# EAGLE design UCirKitBreadboardTop-0824-DemoUse (EAGLE 7.3.0)
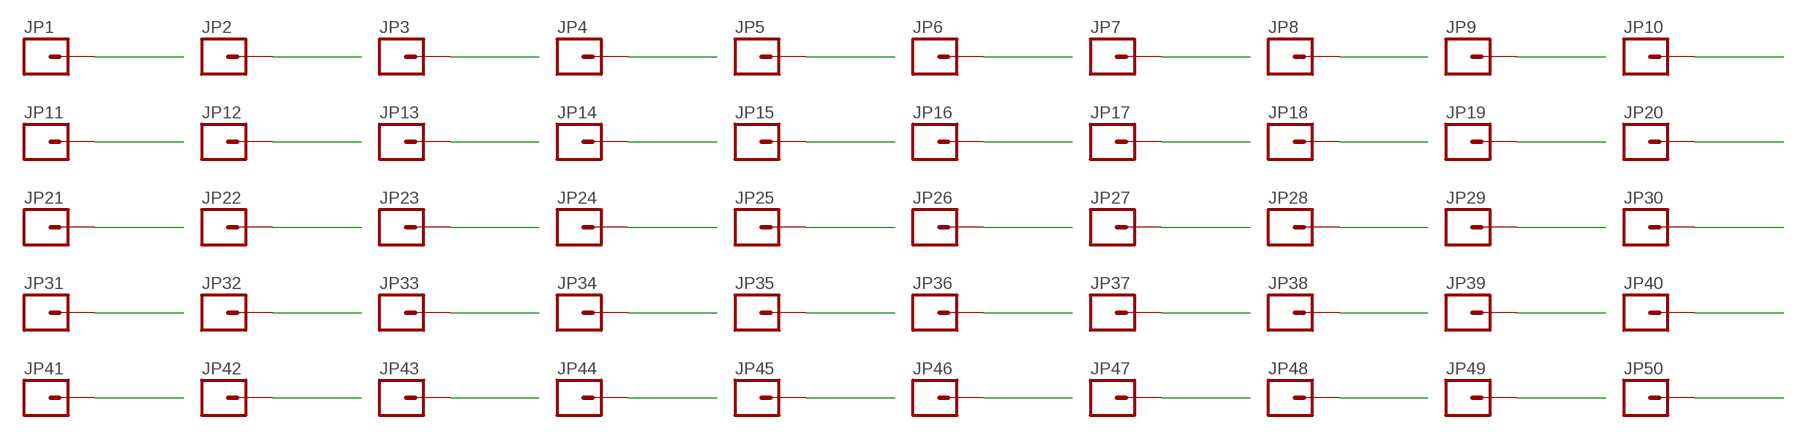
[diagram p0: schematic, sheet 1, part 1 of 2]
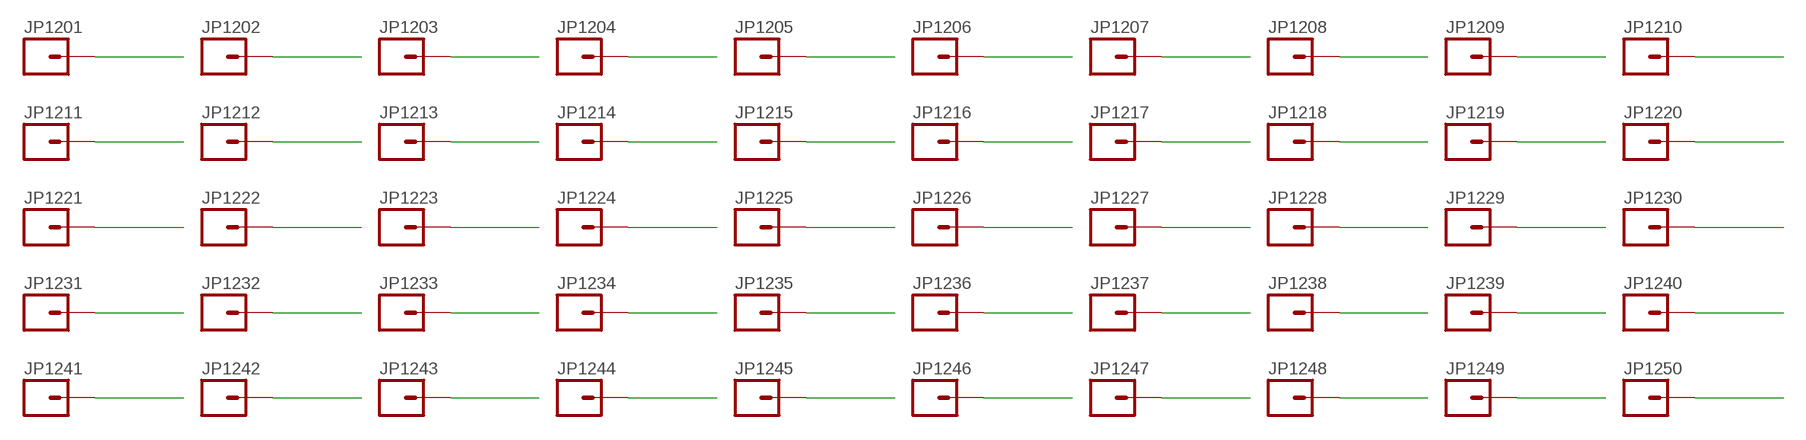
[diagram p1: schematic, sheet 1, part 2 of 2]

## Parts
JP1  M01PTH_WITHOUT_TEXT  [1X01_WITHOUT_TEXT]
JP2  M01PTH_WITHOUT_TEXT  [1X01_WITHOUT_TEXT]
JP3  M01PTH_WITHOUT_TEXT  [1X01_WITHOUT_TEXT]
JP4  M01PTH_WITHOUT_TEXT  [1X01_WITHOUT_TEXT]
JP5  M01PTH_WITHOUT_TEXT  [1X01_WITHOUT_TEXT]
JP6  M01PTH_WITHOUT_TEXT  [1X01_WITHOUT_TEXT]
JP7  M01PTH_WITHOUT_TEXT  [1X01_WITHOUT_TEXT]
JP8  M01PTH_WITHOUT_TEXT  [1X01_WITHOUT_TEXT]
JP9  M01PTH_WITHOUT_TEXT  [1X01_WITHOUT_TEXT]
JP10  M01PTH_WITHOUT_TEXT  [1X01_WITHOUT_TEXT]
JP11  M01PTH_WITHOUT_TEXT  [1X01_WITHOUT_TEXT]
JP12  M01PTH_WITHOUT_TEXT  [1X01_WITHOUT_TEXT]
JP13  M01PTH_WITHOUT_TEXT  [1X01_WITHOUT_TEXT]
JP14  M01PTH_WITHOUT_TEXT  [1X01_WITHOUT_TEXT]
JP15  M01PTH_WITHOUT_TEXT  [1X01_WITHOUT_TEXT]
JP16  M01PTH_WITHOUT_TEXT  [1X01_WITHOUT_TEXT]
JP17  M01PTH_WITHOUT_TEXT  [1X01_WITHOUT_TEXT]
JP18  M01PTH_WITHOUT_TEXT  [1X01_WITHOUT_TEXT]
JP19  M01PTH_WITHOUT_TEXT  [1X01_WITHOUT_TEXT]
JP20  M01PTH_WITHOUT_TEXT  [1X01_WITHOUT_TEXT]
JP21  M01PTH_WITHOUT_TEXT  [1X01_WITHOUT_TEXT]
JP22  M01PTH_WITHOUT_TEXT  [1X01_WITHOUT_TEXT]
JP23  M01PTH_WITHOUT_TEXT  [1X01_WITHOUT_TEXT]
JP24  M01PTH_WITHOUT_TEXT  [1X01_WITHOUT_TEXT]
JP25  M01PTH_WITHOUT_TEXT  [1X01_WITHOUT_TEXT]
JP26  M01PTH_WITHOUT_TEXT  [1X01_WITHOUT_TEXT]
JP27  M01PTH_WITHOUT_TEXT  [1X01_WITHOUT_TEXT]
JP28  M01PTH_WITHOUT_TEXT  [1X01_WITHOUT_TEXT]
JP29  M01PTH_WITHOUT_TEXT  [1X01_WITHOUT_TEXT]
JP30  M01PTH_WITHOUT_TEXT  [1X01_WITHOUT_TEXT]
JP31  M01PTH_WITHOUT_TEXT  [1X01_WITHOUT_TEXT]
JP32  M01PTH_WITHOUT_TEXT  [1X01_WITHOUT_TEXT]
JP33  M01PTH_WITHOUT_TEXT  [1X01_WITHOUT_TEXT]
JP34  M01PTH_WITHOUT_TEXT  [1X01_WITHOUT_TEXT]
JP35  M01PTH_WITHOUT_TEXT  [1X01_WITHOUT_TEXT]
JP36  M01PTH_WITHOUT_TEXT  [1X01_WITHOUT_TEXT]
JP37  M01PTH_WITHOUT_TEXT  [1X01_WITHOUT_TEXT]
JP38  M01PTH_WITHOUT_TEXT  [1X01_WITHOUT_TEXT]
JP39  M01PTH_WITHOUT_TEXT  [1X01_WITHOUT_TEXT]
JP40  M01PTH_WITHOUT_TEXT  [1X01_WITHOUT_TEXT]
JP41  M01PTH_WITHOUT_TEXT  [1X01_WITHOUT_TEXT]
JP42  M01PTH_WITHOUT_TEXT  [1X01_WITHOUT_TEXT]
JP43  M01PTH_WITHOUT_TEXT  [1X01_WITHOUT_TEXT]
JP44  M01PTH_WITHOUT_TEXT  [1X01_WITHOUT_TEXT]
JP45  M01PTH_WITHOUT_TEXT  [1X01_WITHOUT_TEXT]
JP46  M01PTH_WITHOUT_TEXT  [1X01_WITHOUT_TEXT]
JP47  M01PTH_WITHOUT_TEXT  [1X01_WITHOUT_TEXT]
JP48  M01PTH_WITHOUT_TEXT  [1X01_WITHOUT_TEXT]
JP49  M01PTH_WITHOUT_TEXT  [1X01_WITHOUT_TEXT]
JP50  M01PTH_WITHOUT_TEXT  [1X01_WITHOUT_TEXT]
JP1201  M01PTH_SMD_3.25X0.85MM_NO_SILK  [1X01_SMD_3.25X0.85MM_NO_SILK]
JP1202  M01PTH_SMD_3.25X0.85MM_NO_SILK  [1X01_SMD_3.25X0.85MM_NO_SILK]
JP1203  M01PTH_SMD_3.25X0.85MM_NO_SILK  [1X01_SMD_3.25X0.85MM_NO_SILK]
JP1204  M01PTH_SMD_3.25X0.85MM_NO_SILK  [1X01_SMD_3.25X0.85MM_NO_SILK]
JP1205  M01PTH_SMD_3.25X0.85MM_NO_SILK  [1X01_SMD_3.25X0.85MM_NO_SILK]
JP1206  M01PTH_SMD_3.25X0.85MM_NO_SILK  [1X01_SMD_3.25X0.85MM_NO_SILK]
JP1207  M01PTH_SMD_3.25X0.85MM_NO_SILK  [1X01_SMD_3.25X0.85MM_NO_SILK]
JP1208  M01PTH_SMD_3.25X0.85MM_NO_SILK  [1X01_SMD_3.25X0.85MM_NO_SILK]
JP1209  M01PTH_SMD_3.25X0.85MM_NO_SILK  [1X01_SMD_3.25X0.85MM_NO_SILK]
JP1210  M01PTH_SMD_3.25X0.85MM_NO_SILK  [1X01_SMD_3.25X0.85MM_NO_SILK]
JP1211  M01PTH_SMD_3.25X0.85MM_NO_SILK  [1X01_SMD_3.25X0.85MM_NO_SILK]
JP1212  M01PTH_SMD_3.25X0.85MM_NO_SILK  [1X01_SMD_3.25X0.85MM_NO_SILK]
JP1213  M01PTH_SMD_3.25X0.85MM_NO_SILK  [1X01_SMD_3.25X0.85MM_NO_SILK]
JP1214  M01PTH_SMD_3.25X0.85MM_NO_SILK  [1X01_SMD_3.25X0.85MM_NO_SILK]
JP1215  M01PTH_SMD_3.25X0.85MM_NO_SILK  [1X01_SMD_3.25X0.85MM_NO_SILK]
JP1216  M01PTH_SMD_3.25X0.85MM_NO_SILK  [1X01_SMD_3.25X0.85MM_NO_SILK]
JP1217  M01PTH_SMD_3.25X0.85MM_NO_SILK  [1X01_SMD_3.25X0.85MM_NO_SILK]
JP1218  M01PTH_SMD_3.25X0.85MM_NO_SILK  [1X01_SMD_3.25X0.85MM_NO_SILK]
JP1219  M01PTH_SMD_3.25X0.85MM_NO_SILK  [1X01_SMD_3.25X0.85MM_NO_SILK]
JP1220  M01PTH_SMD_3.25X0.85MM_NO_SILK  [1X01_SMD_3.25X0.85MM_NO_SILK]
JP1221  M01PTH_SMD_3.25X0.85MM_NO_SILK  [1X01_SMD_3.25X0.85MM_NO_SILK]
JP1222  M01PTH_SMD_3.25X0.85MM_NO_SILK  [1X01_SMD_3.25X0.85MM_NO_SILK]
JP1223  M01PTH_SMD_3.25X0.85MM_NO_SILK  [1X01_SMD_3.25X0.85MM_NO_SILK]
JP1224  M01PTH_SMD_3.25X0.85MM_NO_SILK  [1X01_SMD_3.25X0.85MM_NO_SILK]
JP1225  M01PTH_SMD_3.25X0.85MM_NO_SILK  [1X01_SMD_3.25X0.85MM_NO_SILK]
JP1226  M01PTH_SMD_3.25X0.85MM_NO_SILK  [1X01_SMD_3.25X0.85MM_NO_SILK]
JP1227  M01PTH_SMD_3.25X0.85MM_NO_SILK  [1X01_SMD_3.25X0.85MM_NO_SILK]
JP1228  M01PTH_SMD_3.25X0.85MM_NO_SILK  [1X01_SMD_3.25X0.85MM_NO_SILK]
JP1229  M01PTH_SMD_3.25X0.85MM_NO_SILK  [1X01_SMD_3.25X0.85MM_NO_SILK]
JP1230  M01PTH_SMD_3.25X0.85MM_NO_SILK  [1X01_SMD_3.25X0.85MM_NO_SILK]
JP1231  M01PTH_SMD_3.25X0.85MM_NO_SILK  [1X01_SMD_3.25X0.85MM_NO_SILK]
JP1232  M01PTH_SMD_3.25X0.85MM_NO_SILK  [1X01_SMD_3.25X0.85MM_NO_SILK]
JP1233  M01PTH_SMD_3.25X0.85MM_NO_SILK  [1X01_SMD_3.25X0.85MM_NO_SILK]
JP1234  M01PTH_SMD_3.25X0.85MM_NO_SILK  [1X01_SMD_3.25X0.85MM_NO_SILK]
JP1235  M01PTH_SMD_3.25X0.85MM_NO_SILK  [1X01_SMD_3.25X0.85MM_NO_SILK]
JP1236  M01PTH_SMD_3.25X0.85MM_NO_SILK  [1X01_SMD_3.25X0.85MM_NO_SILK]
JP1237  M01PTH_SMD_3.25X0.85MM_NO_SILK  [1X01_SMD_3.25X0.85MM_NO_SILK]
JP1238  M01PTH_SMD_3.25X0.85MM_NO_SILK  [1X01_SMD_3.25X0.85MM_NO_SILK]
JP1239  M01PTH_SMD_3.25X0.85MM_NO_SILK  [1X01_SMD_3.25X0.85MM_NO_SILK]
JP1240  M01PTH_SMD_3.25X0.85MM_NO_SILK  [1X01_SMD_3.25X0.85MM_NO_SILK]
JP1241  M01PTH_SMD_3.25X0.85MM_NO_SILK  [1X01_SMD_3.25X0.85MM_NO_SILK]
JP1242  M01PTH_SMD_3.25X0.85MM_NO_SILK  [1X01_SMD_3.25X0.85MM_NO_SILK]
JP1243  M01PTH_SMD_3.25X0.85MM_NO_SILK  [1X01_SMD_3.25X0.85MM_NO_SILK]
JP1244  M01PTH_SMD_3.25X0.85MM_NO_SILK  [1X01_SMD_3.25X0.85MM_NO_SILK]
JP1245  M01PTH_SMD_3.25X0.85MM_NO_SILK  [1X01_SMD_3.25X0.85MM_NO_SILK]
JP1246  M01PTH_SMD_3.25X0.85MM_NO_SILK  [1X01_SMD_3.25X0.85MM_NO_SILK]
JP1247  M01PTH_SMD_3.25X0.85MM_NO_SILK  [1X01_SMD_3.25X0.85MM_NO_SILK]
JP1248  M01PTH_SMD_3.25X0.85MM_NO_SILK  [1X01_SMD_3.25X0.85MM_NO_SILK]
JP1249  M01PTH_SMD_3.25X0.85MM_NO_SILK  [1X01_SMD_3.25X0.85MM_NO_SILK]
JP1250  M01PTH_SMD_3.25X0.85MM_NO_SILK  [1X01_SMD_3.25X0.85MM_NO_SILK]

## Nets
CLEAN0: JP1.1
CLEAN1: JP2.1
CLEAN2: JP3.1
CLEAN3: JP4.1
CLEAN4: JP5.1
CLEAN5: JP6.1
CLEAN6: JP7.1
CLEAN7: JP8.1
CLEAN8: JP9.1
CLEAN9: JP10.1
CLEAN10: JP11.1
CLEAN11: JP12.1
CLEAN12: JP13.1
CLEAN13: JP14.1
CLEAN14: JP15.1
CLEAN15: JP16.1
CLEAN16: JP17.1
CLEAN17: JP18.1
CLEAN18: JP19.1
CLEAN19: JP20.1
CLEAN20: JP21.1
CLEAN21: JP22.1
CLEAN22: JP23.1
CLEAN23: JP24.1
CLEAN24: JP25.1
CLEAN25: JP26.1
CLEAN26: JP27.1
CLEAN27: JP28.1
CLEAN28: JP29.1
CLEAN29: JP30.1
CLEAN30: JP31.1
CLEAN31: JP32.1
CLEAN32: JP33.1
CLEAN33: JP34.1
CLEAN34: JP35.1
CLEAN35: JP36.1
CLEAN36: JP37.1
CLEAN37: JP38.1
CLEAN38: JP39.1
CLEAN39: JP40.1
CLEAN40: JP41.1
CLEAN41: JP42.1
CLEAN42: JP43.1
CLEAN43: JP44.1
CLEAN44: JP45.1
CLEAN45: JP46.1
CLEAN46: JP47.1
CLEAN47: JP48.1
CLEAN48: JP49.1
CLEAN49: JP50.1
CLEAN50: JP1201.P$1
CLEAN51: JP1202.P$1
CLEAN52: JP1203.P$1
CLEAN53: JP1204.P$1
CLEAN54: JP1205.P$1
CLEAN55: JP1206.P$1
CLEAN56: JP1207.P$1
CLEAN57: JP1208.P$1
CLEAN58: JP1209.P$1
CLEAN59: JP1210.P$1
CLEAN60: JP1211.P$1
CLEAN61: JP1212.P$1
CLEAN62: JP1213.P$1
CLEAN63: JP1214.P$1
CLEAN64: JP1215.P$1
CLEAN65: JP1216.P$1
CLEAN66: JP1217.P$1
CLEAN67: JP1218.P$1
CLEAN68: JP1219.P$1
CLEAN69: JP1220.P$1
CLEAN70: JP1221.P$1
CLEAN71: JP1222.P$1
CLEAN72: JP1223.P$1
CLEAN73: JP1224.P$1
CLEAN74: JP1225.P$1
CLEAN75: JP1226.P$1
CLEAN76: JP1227.P$1
CLEAN77: JP1228.P$1
CLEAN78: JP1229.P$1
CLEAN79: JP1230.P$1
CLEAN80: JP1231.P$1
CLEAN81: JP1232.P$1
CLEAN82: JP1233.P$1
CLEAN83: JP1234.P$1
CLEAN84: JP1235.P$1
CLEAN85: JP1236.P$1
CLEAN86: JP1237.P$1
CLEAN87: JP1238.P$1
CLEAN88: JP1239.P$1
CLEAN89: JP1240.P$1
CLEAN90: JP1241.P$1
CLEAN91: JP1242.P$1
CLEAN92: JP1243.P$1
CLEAN93: JP1244.P$1
CLEAN94: JP1245.P$1
CLEAN95: JP1246.P$1
CLEAN96: JP1247.P$1
CLEAN97: JP1248.P$1
CLEAN98: JP1249.P$1
CLEAN99: JP1250.P$1

## Library data of the parts
JP1-JP50 JP1201-JP1250 = SparkFun-Connectors:M01: Header 1 Standard 1-pin 0.1" header. Use with straight break away headers (SKU : PRT-00116), right angle break away headers (PRT-00553), swiss pins (PRT-00743), machine pins (PRT-00117), and female headers (PRT-00115).

## Board
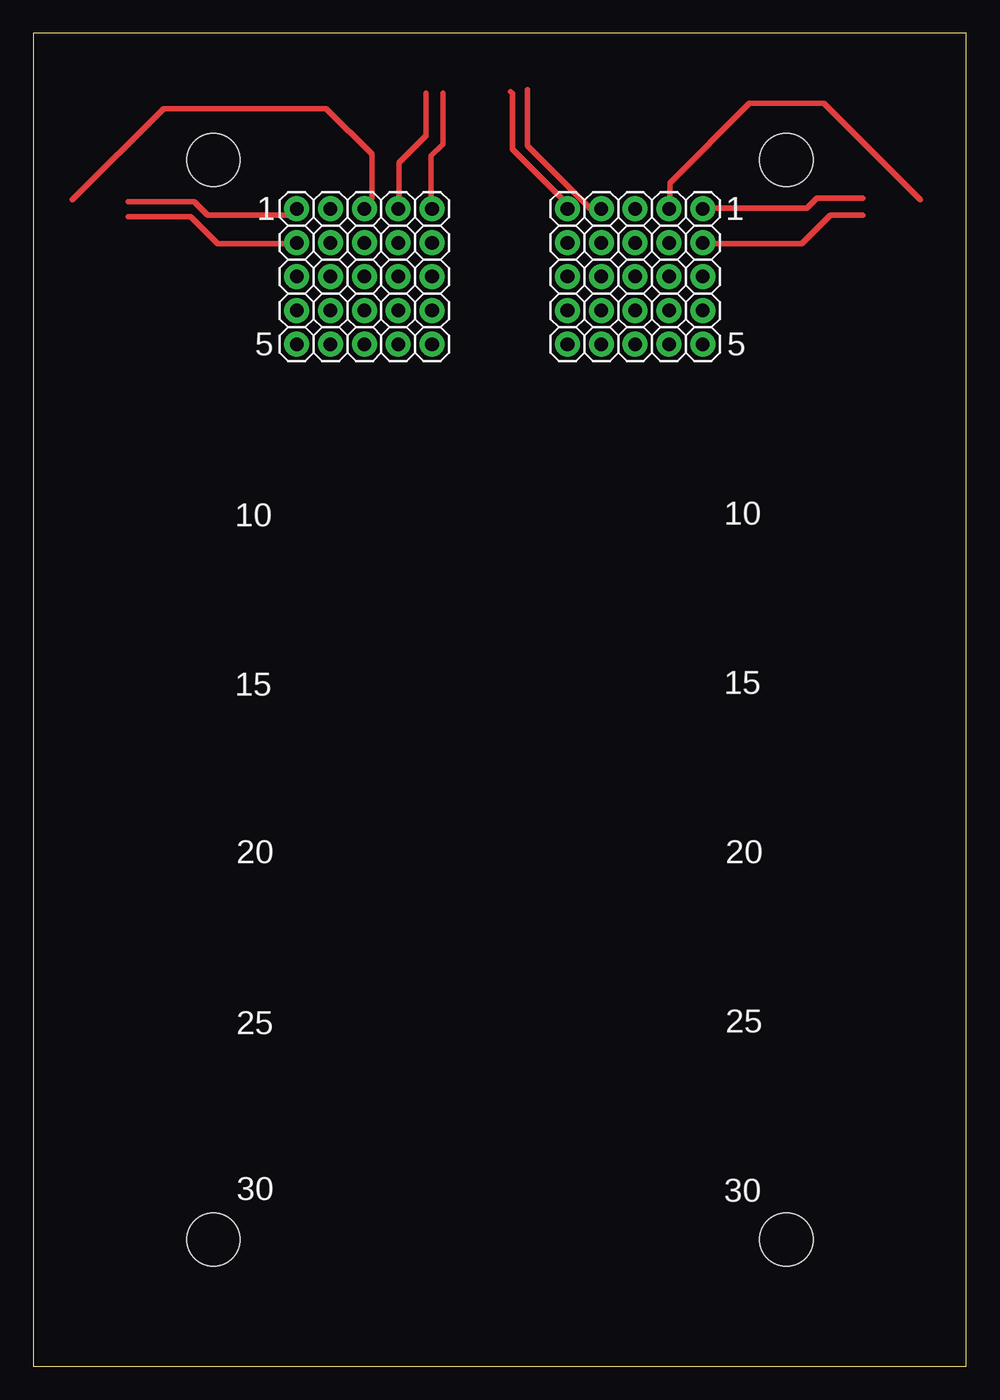
[diagram p2: board, top side]
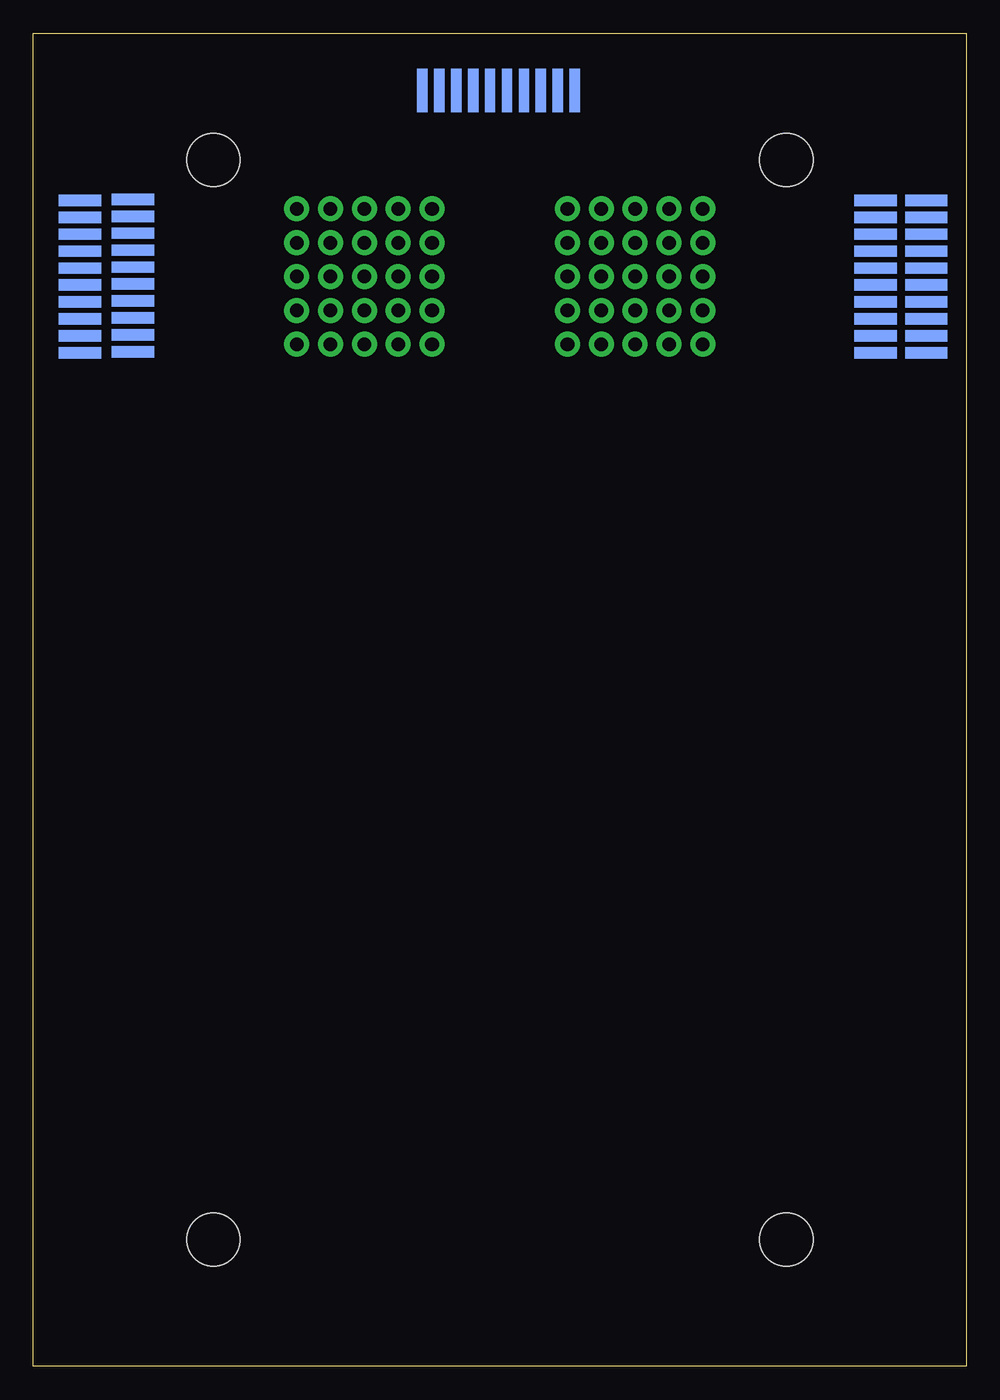
[diagram p3: board, bottom side, seen from below]

Size 70 x 100 mm. Coordinates in mm from the lower left corner, seen from the top.
Outline: 0,0 70,0 70,100 0,100 0,0
Copper layers (1*2*15*16): Top 0.035mm / dielectric 0.2mm / Route2 0.0175mm / dielectric 0.3mm / Route15 0.0175mm / dielectric 0.2mm / Bottom 0.035mm
Design rules "SeeedStudio_4layer_DRU_no_angle_20140221": minimum track width 8mil, minimum drill 12mil, track to track 8mil, track to pad 8mil, pad to pad 8mil, via to via 8mil, smd to smd 0mil, copper to edge 10mil, drill to drill 8mil, minimum pad ring 6mil, minimum via ring 4mil, stop-mask expansion 4mil, vias tented up to drill 100mil, thermal gap 10mil
Holes 4 mm at 13.5,9.5 13.5,90.5 56.5,90.5 56.5,9.5

### Footprints (pad centres in the part's own frame; a part is rotated, then mirrored left to right if it is on the bottom)
1X01_WITHOUT_TEXT = drill 1.016 pad 1.88: 1 0,0
1X01_SMD_3.25X0.85MM_NO_SILK = smd 3.25 x 0.85: P$1 0,0

### Placement (x,y rotation side)
JP1  19.76,86.83 0 top
JP2  22.3,86.83 0 top
JP3  24.84,86.83 0 top
JP4  27.38,86.83 0 top
JP5  29.92,86.83 0 top
JP6  40.08,86.83 0 top
JP7  42.62,86.83 0 top
JP8  45.16,86.83 0 top
JP9  47.7,86.83 0 top
JP10  50.24,86.83 0 top
JP11  19.76,84.29 0 top
JP12  22.3,84.29 0 top
JP13  24.84,84.29 0 top
JP14  27.38,84.29 0 top
JP15  29.92,84.29 0 top
JP16  40.08,84.29 0 top
JP17  42.62,84.29 0 top
JP18  45.16,84.29 0 top
JP19  47.7,84.29 0 top
JP20  50.24,84.29 0 top
JP21  19.76,81.75 0 top
JP22  22.3,81.75 0 top
JP23  24.84,81.75 0 top
JP24  27.38,81.75 0 top
JP25  29.92,81.75 0 top
JP26  40.08,81.75 0 top
JP27  42.62,81.75 0 top
JP28  45.16,81.75 0 top
JP29  47.7,81.75 0 top
JP30  50.24,81.75 0 top
JP31  19.76,79.21 0 top
JP32  22.3,79.21 0 top
JP33  24.84,79.21 0 top
JP34  27.38,79.21 0 top
JP35  29.92,79.21 0 top
JP36  40.08,79.21 0 top
JP37  42.62,79.21 0 top
JP38  45.16,79.21 0 top
JP39  47.7,79.21 0 top
JP40  50.24,79.21 0 top
JP41  19.76,76.67 0 top
JP42  22.3,76.67 0 top
JP43  24.84,76.67 0 top
JP44  27.38,76.67 0 top
JP45  29.92,76.67 0 top
JP46  40.08,76.67 0 top
JP47  42.62,76.67 0 top
JP48  45.16,76.67 0 top
JP49  47.7,76.67 0 top
JP50  50.24,76.67 0 top
JP1201  3,87.47 0 bottom
JP1202  3,86.19 0 bottom
JP1203  3,84.92 0 bottom
JP1204  3,83.66 0 bottom
JP1205  3,82.39 0 bottom
JP1206  3,81.11 0 bottom
JP1207  3,79.84 0 bottom
JP1208  3,78.58 0 bottom
JP1209  3,77.31 0 bottom
JP1210  3,76.03 0 bottom
JP1211  66.5,87.47 0 bottom
JP1212  66.5,86.19 0 bottom
JP1213  66.5,84.92 0 bottom
JP1214  66.5,83.66 0 bottom
JP1215  66.5,82.39 0 bottom
JP1216  66.5,81.11 0 bottom
JP1217  66.5,79.84 0 bottom
JP1218  66.5,78.58 0 bottom
JP1219  66.5,77.31 0 bottom
JP1220  66.5,76.03 0 bottom
JP1221  62.53,76.11 180 bottom
JP1222  62.53,77.38 180 bottom
JP1223  62.53,78.65 180 bottom
JP1224  62.53,79.92 180 bottom
JP1225  62.53,81.19 180 bottom
JP1226  62.53,82.46 180 bottom
JP1227  62.53,83.73 180 bottom
JP1228  62.53,85 180 bottom
JP1229  62.53,86.27 180 bottom
JP1230  62.53,87.54 180 bottom
JP1231  6.81,87.47 0 bottom
JP1232  6.81,86.19 0 bottom
JP1233  6.81,84.92 0 bottom
JP1234  6.81,83.66 0 bottom
JP1235  6.81,82.39 0 bottom
JP1236  6.81,81.11 0 bottom
JP1237  6.81,79.84 0 bottom
JP1238  6.81,78.58 0 bottom
JP1239  6.81,77.31 0 bottom
JP1240  6.81,76.03 0 bottom
JP1241  29.38,95.71 270 bottom
JP1242  30.64,95.71 270 bottom
JP1243  31.91,95.71 270 bottom
JP1244  33.19,95.71 270 bottom
JP1245  34.45,95.71 270 bottom
JP1246  35.73,95.71 270 bottom
JP1247  36.99,95.71 270 bottom
JP1248  38.27,95.71 270 bottom
JP1249  39.53,95.71 270 bottom
JP1250  40.8,95.71 270 bottom

### Tracks (layer width: path | path; a pad name or v marks a point on that pad's centre or on a via)
N$1
  Top 0.406: 20.32,86.36 13.08,86.36 12.06,87.38 7.11,87.38
N$2
  Top 0.406: 19.81,84.2 13.84,84.2 11.81,86.23 7.11,86.23
N$3
  Top 0.406: 27.43,86.87 27.43,90.3 29.46,92.33 29.46,95.5
N$4
  Top 0.406: 29.84,86.87 29.84,90.81 30.73,91.69 30.73,95.5
N$5
  Top 0.406: 25.4,87.63 25.4,90.93 21.97,94.36 9.78,94.36 2.92,87.5
N$6
  Top 0.406: 40.26,86.87 40.26,87 35.94,91.31 35.94,95.5 35.81,95.63
N$7
  Top 0.406: 42.67,86.87 41.78,86.87 37.08,91.57 37.08,95.76
N$8
  Top 0.406: 50.29,86.87 58.04,86.87 58.8,87.63 62.23,87.63
N$9
  Top 0.406: 50.29,84.2 57.66,84.2 59.82,86.36 62.23,86.36
N$10
  Top 0.406: 47.75,86.87 47.75,88.77 53.72,94.74 59.31,94.74 66.55,87.5

### Text on the board
tPlace: 1 | 1 | 5 | 5 | 10 | 10 | 15 | 15 | 20 | 20 | 25 | 25 | 30 | 30